# Altium schematic sheet PWR_Schem_1.SchDoc
size A; SheetNumber: 1; SheetTotal: 1
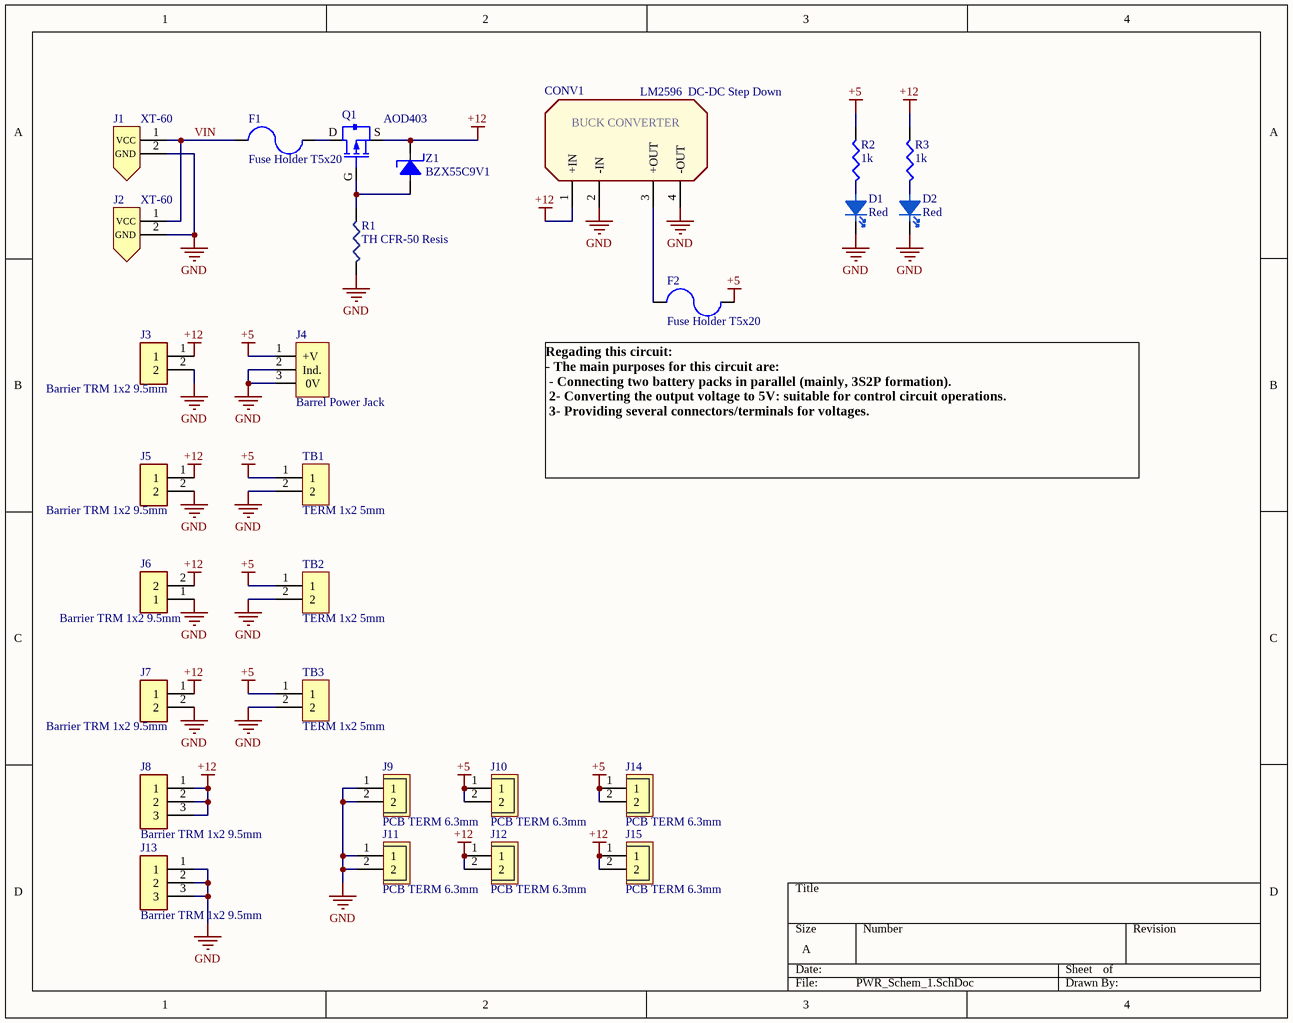
[diagram p0: PWR_Schem_1.SchDoc]

## Parts
CONV1  LM2596  DC-DC Step Down  [DC_STP_DWN]
D1  Red  [LED_TH_2.54mm]
D2  Red  [LED_TH_2.54mm]
F1  Fuse Holder T5x20  [FUSE]
F2  Fuse Holder T5x20  [FUSE]
J1  XT-60  [XT-60_FEM]
J2  XT-60  [XT-60_FEM]
J3  Barrier TRM 1x2 9.5mm  [BARRIER_9.5MM]
J4  Barrel Power Jack  [pwr_Jack]
J5  Barrier TRM 1x2 9.5mm  [BARRIER_9.5MM]
J6  Barrier TRM 1x2 9.5mm  [BARRIER_9.5MM]
J7  Barrier TRM 1x2 9.5mm  [BARRIER_9.5MM]
J8  Barrier TRM 1x2 9.5mm  [BARRIER_3_9.5MM]
J9  PCB TERM 6.3mm  [PCB_TERM 6.3mm]
J10  PCB TERM 6.3mm  [PCB_TERM 6.3mm]
J11  PCB TERM 6.3mm  [PCB_TERM 6.3mm]
J12  PCB TERM 6.3mm  [PCB_TERM 6.3mm]
J13  Barrier TRM 1x2 9.5mm  [BARRIER_3_9.5MM]
J14  PCB TERM 6.3mm  [PCB_TERM 6.3mm]
J15  PCB TERM 6.3mm  [PCB_TERM 6.3mm]
Q1  AOD403  [DPAK]
R1  TH CFR-50 Resis  [R_THT_CFR-50]
R2  1k  [R_THT_CFR-25]
R3  1k  [R_THT_CFR-25]
TB1  TERM 1x2 5mm  [Terminal_5mm]
TB2  TERM 1x2 5mm  [Terminal_5mm]
TB3  TERM 1x2 5mm  [Terminal_5mm]
Z1  BZX55C9V1  [DO-35]

## Nets
+5: F2.2 J4.1(+V) J10.1 J10.2 J14.1 J14.2 R2.2 TB1.1 TB2.1 TB3.1
+12: CONV1.1(+IN) J3.1 J5.1 J6.2 J7.1 J8.1 J8.2 J8.3 J12.1 J12.2 J15.1 J15.2 Q1.S R3.2 Z1.K(Cathode)
GND: CONV1.2(-IN) CONV1.4(-OUT) D1.2(Cathode) D2.2(Cathode) J1.2(GND) J2.2(GND) J3.2 J4.2(Ind.) J4.3(0V) J5.2 J6.1 J7.2 J9.1 J9.2 J11.1 J11.2 J13.1 J13.2 J13.3 R1.1 TB1.2 TB2.2 TB3.2
VIN: F1.1 J1.1(VCC) J2.1(VCC)
NetCONV1_3: CONV1.3(+OUT) F2.1
NetD1_1: D1.1(Anode) R2.1
NetD2_1: D2.1(Anode) R3.1
NetF1_2: F1.2 Q1.D
NetQ1_G: Q1.G R1.2 Z1.A(Anode)

## Notes on the sheet
- (near F2) Regading this circuit:
  - The main purposes for this circuit are:
  - Connecting two battery packs in parallel (mainly, 3S2P formation).
  2- Converting the output voltage to 5V: suitable for control circuit operations.
  3- Providing several connectors/terminals for voltages.
- (in symbol Buck Conv.) BUCK CONVERTER

## Library data of the parts
CONV1 = Buck Conv.: Conv DC-DC 4.5V to 40V Inv/Step Down Single-Out 1.2V to 37V 3A 6-Pin(5+Tab) TO-263 Tube; Manufacturer 1: Texas Instruments; Manufacturer Part Number 1: LM2596S-ADJ/NOPB; Number of Outputs: 1; Parameter Name 1: Rail/Tube; Switching Frequency: 173kHz; Efficiency: 73%; Quiescent Current: 5mA; Output Type: Adjustable; Supplier 1: Digi-Key; Stock 1: 4513; Pricing 1: 1=5.72000, 10=5.14100, 25=4.86000, 100=3.99600, 250=3.58560, 500=3.45600, 1000=2.87280, 2500=2.76480, 5000=2.67840 (USD); Mount: Surface Mount; Case/Package: TO-263; Number of Pins: 5; Weight: 0.056128oz; Contact Plating: Tin; Min Operating Temperature: -40°C; Max Operating Temperature: 125°C; Output Voltage: 37V; Max Output Current: 3A; Min Input Voltage: 4.5V; Max Input Voltage: 40V; Output Current: 3A; Max Output Voltage: 37V; Min Output Voltage: 1.2V; Operating Supply Voltage: 40V; Length: 10.16mm; Height: 4.57mm; Width: 8.64mm; Radiation Hardening: No; REACH SVHC: No SVHC; Lead Free: Contains Lead; ComponentLink1URL: https://datasheet.ciiva.com/27056/2051160-27056491.pdf?src-supplier=Jameco; ComponentLink1Description: https://datasheet.ciiva.com/27056/2051160-27056491.pdf?src-supplier=Jameco; ComponentLink2URL: https://datasheet.ciiva.com/15112/getdatasheetpartid-55559-15112636.pdf?src-supplier=Verical; ComponentLink2Description: https://datasheet.ciiva.com/15112/getdatasheetpartid-55559-15112636.pdf?src-supplier=Verical; ComponentLink3URL: https://datasheet.ciiva.com/41457/001013814-da-01-en-ic-reg-buc-lm2596s-adj-nopb-to-263-5-tid-41457756.pdf?src-supplier=Conrad; ComponentLink3Description: https://datasheet.ciiva.com/41457/001013814-da-01-en-ic-reg-buc-lm2596s-adj-nopb-to-263-5-tid-41457756.pdf?src-supplier=Conrad; ComponentLink4URL: https://datasheet.ciiva.com/6596/lm2596-6596342.pdf?src-supplier=Digi-Key; ComponentLink4Description: https://datasheet.ciiva.com/6596/lm2596-6596342.pdf?src-supplier=Digi-Key; ComponentLink5URL: https://datasheet.ciiva.com/22669/1874590-22669464.pdf?src-supplier=Element14; ComponentLink5Description: https://datasheet.ciiva.com/22669/1874590-22669464.pdf?src-supplier=Element14; ComponentLink6URL: https://datasheet.ciiva.com/14150/jqlm2596x-xx-e-14150653.pdf?src-supplier=Distrelec; ComponentLink6Description: https://datasheet.ciiva.com/14150/jqlm2596x-xx-e-14150653.pdf?src-supplier=Distrelec; ComponentLink7URL: https://octopart.com/click/track?ai=10049&ct=datasheets&sig=08a4c86&at=physicalpart&sid=370&ppid=24812941&hlid=29972682&src-supplier=TI+store; ComponentLink7Description: https://octopart.com/click/track?ai=10049&ct=datasheets&sig=08a4c86&at=physicalpart&sid=370&ppid=24812941&hlid=29972682&src-supplier=TI+store; ComponentLink8URL: http://datasheet.octopart.com/LM2596S-ADJ-NOPB-Texas-Instruments-datasheet-34438175.pdf?src-supplier=TME; ComponentLink8Description: http://datasheet.octopart.com/LM2596S-ADJ-NOPB-Texas-Instruments-datasheet-34438175.pdf?src-supplier=TME; ComponentLink9URL: http://datasheet.octopart.com/LM2596S-ADJ/NOPB-Texas-Instruments-datasheet-10621667.pdf?src-supplier=Verical; ComponentLink9Description: http://datasheet.octopart.com/LM2596S-ADJ/NOPB-Texas-Instruments-datasheet-10621667.pdf?src-supplier=Verical; ComponentLink10URL: http://datasheet.octopart.com/LM2596S-ADJ-NOPB-Texas-Instruments-datasheet-14775467.pdf?src-supplier=TI+store; ComponentLink10Description: http://datasheet.octopart.com/LM2596S-ADJ-NOPB-Texas-Instruments-datasheet-14775467.pdf?src-supplier=TI+store; ComponentLink11URL: http://sigma.octopart.com/49250911/technical_drawing/Texas-Instruments-LM2596S-ADJ-NOPB.pdf?src-supplier=TI+store; ComponentLink11Description: http://sigma.octopart.com/49250911/technical_drawing/Texas-Instruments-LM2596S-ADJ-NOPB.pdf?src-supplier=TI+store; ComponentLink12URL: http://datasheet.octopart.com/LM2596S-ADJ/NOPB-National-Semiconductor-datasheet-6038.pdf?src-supplier=Future+Electronics; ComponentLink12Description: http://datasheet.octopart.com/LM2596S-ADJ/NOPB-National-Semiconductor-datasheet-6038.pdf?src-supplier=Future+Electronics; ComponentLink13URL: http://datasheet.octopart.com/LM2596S-ADJ-NOPB-Texas-Instruments-datasheet-21076667.pdf?src-supplier=Newark; ComponentLink13Description: http://datasheet.octopart.com/LM2596S-ADJ-NOPB-Texas-Instruments-datasheet-21076667.pdf?src-supplier=Newark; ComponentLink14URL: http://datasheet.octopart.com/LM2596S-ADJ-NOPB-Texas-Instruments-datasheet-9136.pdf?src-supplier=Element14; ComponentLink14Description: http://datasheet.octopart.com/LM2596S-ADJ-NOPB-Texas-Instruments-datasheet-9136.pdf?src-supplier=Element14; ComponentLink15URL: http://datasheet.octopart.com/LM2596S-ADJ-NOPB-Texas-Instruments-datasheet-65712979.pdf?src-supplier=Newark; ComponentLink15Description: http://datasheet.octopart.com/LM2596S-ADJ-NOPB-Texas-Instruments-datasheet-65712979.pdf?src-supplier=Newark; ComponentLink16URL: http://datasheet.octopart.com/LM2596S-ADJ-NOPB-Texas-Instruments-datasheet-8528656.pdf?src-supplier=Element14; ComponentLink16Description: http://datasheet.octopart.com/LM2596S-ADJ-NOPB-Texas-Instruments-datasheet-8528656.pdf?src-supplier=Element14; ComponentLink17URL: http://datasheet.octopart.com/LM2596S-ADJ-NOPB-Texas-Instruments-datasheet-10845692.pdf?src-supplier=Element14; ComponentLink17Description: http://datasheet.octopart.com/LM2596S-ADJ-NOPB-Texas-Instruments-datasheet-10845692.pdf?src-supplier=Element14; ComponentLink18URL: http://datasheet.octopart.com/LM2596S-ADJ-NOPB-Texas-Instruments-datasheet-7596510.pdf?src-supplier=Jameco; ComponentLink18Description: http://datasheet.octopart.com/LM2596S-ADJ-NOPB-Texas-Instruments-datasheet-7596510.pdf?src-supplier=Jameco; ComponentLink19URL: http://datasheet.octopart.com/LM2596S-ADJ-NOPB-Texas-Instruments-datasheet-62342754.pdf?src-supplier=TME; ComponentLink19Description: http://datasheet.octopart.com/LM2596S-ADJ-NOPB-Texas-Instruments-datasheet-62342754.pdf?src-supplier=TME; ComponentLink20URL: http://datasheet.octopart.com/LM2596S-ADJ-NOPB-Texas-Instruments-datasheet-17726397.pdf?src-supplier=Upverter; ComponentLink20Description: http://datasheet.octopart.com/LM2596S-ADJ-NOPB-Texas-Instruments-datasheet-17726397.pdf?src-supplier=Upverter; ComponentLink21URL: http://datasheet.octopart.com/LM2596S-ADJ/NOPB-National-Semiconductor-datasheet-9599829.pdf?src-supplier=Allied+Electronics; ComponentLink21Description: http://datasheet.octopart.com/LM2596S-ADJ/NOPB-National-Semiconductor-datasheet-9599829.pdf?src-supplier=Allied+Electronics; Supplier Part Number 1: LM2596S-ADJ/NOPB-ND
D1 D2 = TH Red LED 5mm: LED RED DIFF 5MM OVAL T/H; Manufacturer 1: Marktech Optoelectronics; Manufacturer Part Number 1: MT5470E-UR; Dominant Wavelength: 625nm; Luminous Intensity: 2300mcd; Test Current: 20mA; Lens Transparency: Diffused; Forward Voltage: 2.1V; Lens Style: Diffused,Tinted; Parameter Name 1: Bulk; Viewing Angle: 70°; Supplier 1: Digi-Key; Stock 1: 7117; Pricing 1: 1=0.61000, 10=0.44100, 100=0.28800, 500=0.20700, 1000=0.16200, 2500=0.14850, 5000=0.13500, 10000=0.12600, 25000=0.12150 (USD); RoHS: Yes; Mount: Through Hole; Case/Package: Radial; Lens Color: Red; Color: Red; Package Quantity: 5000; Height: 7.8mm; ComponentLink1URL: https://datasheet.ciiva.com/18614/mt5470e-ur-18614243.pdf?src-supplier=Digi-Key; ComponentLink1Description: https://datasheet.ciiva.com/18614/mt5470e-ur-18614243.pdf?src-supplier=Digi-Key; Supplier Part Number 1: 1125-1193-ND
F1 F2 = FUSE_T5x20
J1 J2 = XT-60 Power Female Con.: XT60 CONNECTORS MALE/FEMALE PAIR; Manufacturer 1: SparkFun; Manufacturer Part Number 1: PRT-10474; Supplier 1: Digi-Key; Stock 1: 3168; Pricing 1: 1=1.50000 (USD); RoHS: No; ComponentLink1URL: https://cdn.sparkfun.com/datasheets/Prototyping/xt60.pdf?src-supplier=Digi-Key; ComponentLink1Description: https://cdn.sparkfun.com/datasheets/Prototyping/xt60.pdf?src-supplier=Digi-Key; Supplier Part Number 1: 1568-1816-ND
J3 J5-J7 = Barrier BLK: CONN BARRIER STRIP 2CIRC 0.374"; Manufacturer 1: On-Shore Technology; Manufacturer Part Number 1: OSTYK44102030; Current Rating: 30A; Voltage Rating: 300V; Parameter Name 1: Bulk; Number of Circuits: 2; Wire Gauge (Max): 22AWG; Wire Gauge (Min): 10AWG; Pitch: 0.374inch; Supplier 1: Digi-Key; Stock 1: 3505; Pricing 1: 1=1.22000, 10=0.76100, 25=0.65160, 50=0.58560, 100=0.57340, 250=0.48800, 500=0.46360, 1000=0.41480, 5000=0.32452 (USD); RoHS: Yes; Mount: Through Hole; Color: Black; Insulation Material: Nylon; Min Operating Temperature: -40°C; Max Operating Temperature: 105°C; Number of Rows: 1; Number of Wire Entries: 2; Flammability Rating: UL94 V-0; ComponentLink1URL: https://datasheet.ciiva.com/778/ostyk441xx030-778584.pdf?src-supplier=Digi-Key; ComponentLink1Description: https://datasheet.ciiva.com/778/ostyk441xx030-778584.pdf?src-supplier=Digi-Key; Supplier Part Number 1: ED2971-ND
J4 = Con-Jack: DC-Power Socket 12V 5A 2, 1mm Solder Eyel; Manufacturer 1: Cliff; Manufacturer Part Number 1: FC68148; Parameter Name 1: Bulk; Inside Diameter: 6.3mm; Supplier 1: Conrad; RoHS: Yes; Weight: 0.1lb; Current Rating: 5A; Orientation: Right Angle; Connector Type: Socket; Length: 5inch; Height: 0.25inch; Width: 3inch; ComponentLink1URL: http://www.farnell.com/datasheets/317160.pdf?src-supplier=Farnell; ComponentLink1Description: http://www.farnell.com/datasheets/317160.pdf?src-supplier=Farnell; ComponentLink2URL: http://www.rapidonline.com/pdf/735742_da_en_01.pdf?src-supplier=Rapid+Electronics; ComponentLink2Description: http://www.rapidonline.com/pdf/735742_da_en_01.pdf?src-supplier=Rapid+Electronics; ComponentLink3URL: http://www.produktinfo.conrad.com/datenblaetter/725000-749999/735742-da-01-en-DC_BUCHSE_2_1MM_FC68148.pdf?src-supplier=Conrad; ComponentLink3Description: http://www.produktinfo.conrad.com/datenblaetter/725000-749999/735742-da-01-en-DC_BUCHSE_2_1MM_FC68148.pdf?src-supplier=Conrad; Supplier Part Number 1: 735742
J8 J13 = Barrier BLK_3: CONN BARRIER STRIP 3CIRC 0.374"; Manufacturer 1: On-Shore Technology; Manufacturer Part Number 1: OSTYK44102030; Current Rating: 30A; Voltage Rating: 300V; Parameter Name 1: Bulk; Number of Circuits: 2; Wire Gauge (Max): 22AWG; Wire Gauge (Min): 10AWG; Pitch: 0.374inch; Supplier 1: Digi-Key; Stock 1: 3505; Pricing 1: 1=1.22000, 10=0.76100, 25=0.65160, 50=0.58560, 100=0.57340, 250=0.48800, 500=0.46360, 1000=0.41480, 5000=0.32452 (USD); RoHS: Yes; Mount: Through Hole; Color: Black; Insulation Material: Nylon; Min Operating Temperature: -40°C; Max Operating Temperature: 105°C; Number of Rows: 1; Number of Wire Entries: 2; Flammability Rating: UL94 V-0; ComponentLink1URL: https://datasheet.ciiva.com/778/ostyk441xx030-778584.pdf?src-supplier=Digi-Key; ComponentLink1Description: https://datasheet.ciiva.com/778/ostyk441xx030-778584.pdf?src-supplier=Digi-Key; Supplier Part Number 1: ED2971-ND
J9-J12 J14 J15 = PCB Terminal: Manufacturer 1: TE Connectivity; Manufacturer Part Number 1: 2-644861-2; Underplate Material: Nickel; Number of Contacts: 2; Connector Type: Plug,Header,Pin; Voltage Rating: 250V; Mating Alignment: Yes (With); PCB Mount Retention: Without; PCB Mounting Orientation: Vertical; Gender: Male; Current Rating: 5A; Contact Resistance: 6mR; Contact Retention: No (Without); Connector System: Wire-to-Board; Contact Style: Straight; Pitch: 2.54mm; Contact Post Length: 3.56mm; Plating Thickness: 6.3um; PCB Thickness: 0.063inch; Approvals: CSA; Supplier 1: Digi-Key; Stock 1: 3206; Pricing 1: 1=0.41000, 10=0.39200, 100=0.27420, 500=0.23506, 1000=0.19588, 5000=0.16790, 10000=0.15670 (USD); RoHS: Yes; Mount: Through Hole; Housing Color: Black; Contact Plating: Tin,Matte; Contact Material: Copper Alloy; Housing Material: Polyester; Color: Black; Contact Shape: Square; Min Operating Temperature: -67°C; Max Operating Temperature: 221°C; Termination: Solder; Number of Rows: 1; Number of Positions: 2; Package Quantity: 500; Packaging: Bag; Contact Gender: Male; Orientation: Straight; Fastening Type: Friction; Max Voltage Rating (AC): 250V; Shrouded: Yes (With); Voltage Rating (AC): 250V; Mating Retention: Yes (With); PCB Mount Alignment: No (Without); Sealable: No (Without); Contact Current Rating: 5A; Strain Relief: No (Without); Backwall/Post Interruptions: No (Without); Length: 7.21mm; Height: 10.41mm; Contact Mating Length: 5.1mm; Depth: 7.95mm; Tail Length: 3.56mm; Radiation Hardening: No; Flammability Rating: UL94 V-0; ELV: Compliant; Lead Free: Lead Free; REACH SVHC: Unknown; ComponentLink1URL: https://datasheet.ciiva.com/16303/eng-ds-82056-mta-0608-16303634.pdf?src-supplier=Future+Electronics; ComponentLink1Description: https://datasheet.ciiva.com/16303/eng-ds-82056-mta-0608-16303634.pdf?src-supplier=Future+Electronics; ComponentLink2URL: https://datasheet.ciiva.com/30111/8852eng-ds-82056-mta-0608-30111398.pdf?src-supplier=Onlinecomponents.com; ComponentLink2Description: https://datasheet.ciiva.com/30111/8852eng-ds-82056-mta-0608-30111398.pdf?src-supplier=Onlinecomponents.com; ComponentLink3URL: https://datasheet.ciiva.com/709/eng-cd-644861-n-basefilename-709739.pdf?src-supplier=Digi-Key; ComponentLink3Description: https://datasheet.ciiva.com/709/eng-cd-644861-n-basefilename-709739.pdf?src-supplier=Digi-Key; ComponentLink4URL: https://datasheet.ciiva.com/3118/eng-ds-82056-mta-0608-3118126.pdf?src-supplier=Avnet; ComponentLink4Description: https://datasheet.ciiva.com/3118/eng-ds-82056-mta-0608-3118126.pdf?src-supplier=Avnet; Supplier Part Number 1: A30931-ND
Q1 = AOD403: MOSFET Transistor P-Channel 30V 15A 3.5V @ 250uA 6mΩ @ 20A,20V 2.5W TO-252-2(DPAK)
R1 = TH CFR-50 Resis: General Type Carbon Film Resistor 330Ohm 1/2W 5% Axial Bulk; Manufacturer 1: Yageo; Manufacturer Part Number 1: CFR-50JB-52-330R; Temperature Coefficient: 500ppm/°C; Resistance: 330R; Max Power Dissipation: 500mW; Supplier 1: Digi-Key; Stock 1: 1637; Pricing 1: 1=0.11000, 10=0.09800, 25=0.06800, 50=0.05300, 100=0.03780, 250=0.02948, 500=0.02344, 1000=0.01663, 5000=0.01285 (USD); RoHS: Yes; Case/Package: Axial; Min Operating Temperature: -55°C; Max Operating Temperature: 155°C; Resistor Type: Carbon Film; Number of Terminations: 2; Package Quantity: 200; Packaging: Bulk; Tolerance: 5%; Length: 0.354inch; ComponentLink1URL: http://www.yageo.com/documents/recent/Yageo%20LR_CFR_2013.pdf?src-supplier=Digi-Key; ComponentLink1Description: http://www.yageo.com/documents/recent/Yageo%20LR_CFR_2013.pdf?src-supplier=Digi-Key
R2 R3 = TH CFR-25 Resis: CFR Series 0.25 W 1 KOhm ±5 % -350 to 500 ppm/°C Carbon Film Resistor; Manufacturer 1: Yageo; Manufacturer Part Number 1: CFR-25JB-52-1K; Tolerance: 5%; Resistance: 1kR; Max Power Dissipation: 250mW; Parameter Name 1: Bulk; Supplier 1: Digi-Key; Stock 1: 194074; Pricing 1: 1=0.10000, 25=0.04680, 50=0.03640, 100=0.02600, 250=0.02028, 500=0.01612, 750=0.01379, 1000=0.01144, 2000=0.00988 (USD); RoHS: Yes; Case/Package: Axial; Min Operating Temperature: -55°C; Max Operating Temperature: 155°C; Temperature Coefficient: 500ppm/°C; Resistor Type: Carbon Film; Number of Terminations: 2; Package Quantity: 200; Power Rating: 250mW; Length: 0.248inch; Lead Free: Lead Free; ComponentLink1URL: http://www.yageo.com/NewPortal/yageodocoutput?fileName=/pdf/throughhole/Yageo_LR_CFR_2013.pdf&src-supplier=Digi-Key; ComponentLink1Description: http://www.yageo.com/NewPortal/yageodocoutput?fileName=/pdf/throughhole/Yageo_LR_CFR_2013.pdf&src-supplier=Digi-Key; ComponentLink2URL: http://www.yageo.com/documents/recent/General%20Type_CFR.pdf?src-supplier=Future+Electronics; ComponentLink2Description: http://www.yageo.com/documents/recent/General%20Type_CFR.pdf?src-supplier=Future+Electronics; Supplier Part Number 1: 1.0KQBK-ND
TB1-TB3 = Terminal BLK Green: PHOENIX CONTACT         MKDSN 1,5/ 2             Wire-To-Board Terminal Block, 5 mm, 2 Ways, 26 AWG, 16 AWG, 1.5 mm, Screw; Manufacturer Part Number 1: 1729018; Parameter Name 1: Bulk; Number of Positions: 2; Current Rating: 13.5A; Number of Levels: 1; Current: 10A; Gender: Male; Voltage Rating: 400V; Voltage: 300V; Max Supply Voltage: 250V; Wire Gauge (Max): 26AWG; Stripping Length: 6mm; Approvals: UL,CSA,cULus,CB; Supplier 1: Mouser; Manufacturer 1: Phoenix Contact; Stock 1: 6371; Pricing 1: 1=1.10000, 10=1.05000, 50=1.01000, 100=0.97400, 250=0.91000, 500=0.83800 (USD); RoHS: Yes; Mount: Through Hole; Number of Pins: 2; Weight: 0.06949oz; Color: Green; Material: Polyamide; Housing Material: Polyamide; Housing Color: Green; Contact Material: Tin; Insulation Material: Nylon; Package Quantity: 50; Termination: Screw; Number of Positions Per Level: 2; Number of Contacts: 2; Number of Circuits: 2; Connector Type: Screw; Orientation: Straight; Number of Rows: 1; Max Current Rating: 13.5A; Number of Poles: 2; Length: 8.1mm; Height: 13.5mm; Pitch: 5mm; Wire Gauge (Min): 26AWG; Depth: 8.1mm; Width: 13.5mm; Wire/Cable Gauge: 26AWG; Radiation Hardening: No; REACH SVHC: Unknown; Flammability Rating: UL94 V-0; Lead Free: Lead Free; ComponentLink1URL: https://datasheet.ciiva.com/16071/1729018-16071814.pdf?src-supplier=Onlinecomponents.com; ComponentLink1Description: https://datasheet.ciiva.com/16071/1729018-16071814.pdf?src-supplier=Onlinecomponents.com; ComponentLink2URL: https://datasheet.ciiva.com/832/1729018-832055.pdf?src-supplier=Digi-Key; ComponentLink2Description: https://datasheet.ciiva.com/832/1729018-832055.pdf?src-supplier=Digi-Key; ComponentLink3URL: https://datasheet.ciiva.com/15169/getdatasheetpartid-177860-15169643.pdf?src-supplier=Verical; ComponentLink3Description: https://datasheet.ciiva.com/15169/getdatasheetpartid-177860-15169643.pdf?src-supplier=Verical; ComponentLink4URL: https://datasheet.ciiva.com/14607/70054375-14607356.pdf?src-supplier=Allied+Electronics; ComponentLink4Description: https://datasheet.ciiva.com/14607/70054375-14607356.pdf?src-supplier=Allied+Electronics; ComponentLink5URL: https://datasheet.ciiva.com/33105/1729018-33105978.pdf?src-supplier=Today+Components; ComponentLink5Description: https://datasheet.ciiva.com/33105/1729018-33105978.pdf?src-supplier=Today+Components; Supplier Part Number 1: 651-1729018
Z1 = Zener_DO-35: TH Zener Diode DO-35